# EAGLE design 4-digit-clock (EAGLE 7.5.0)
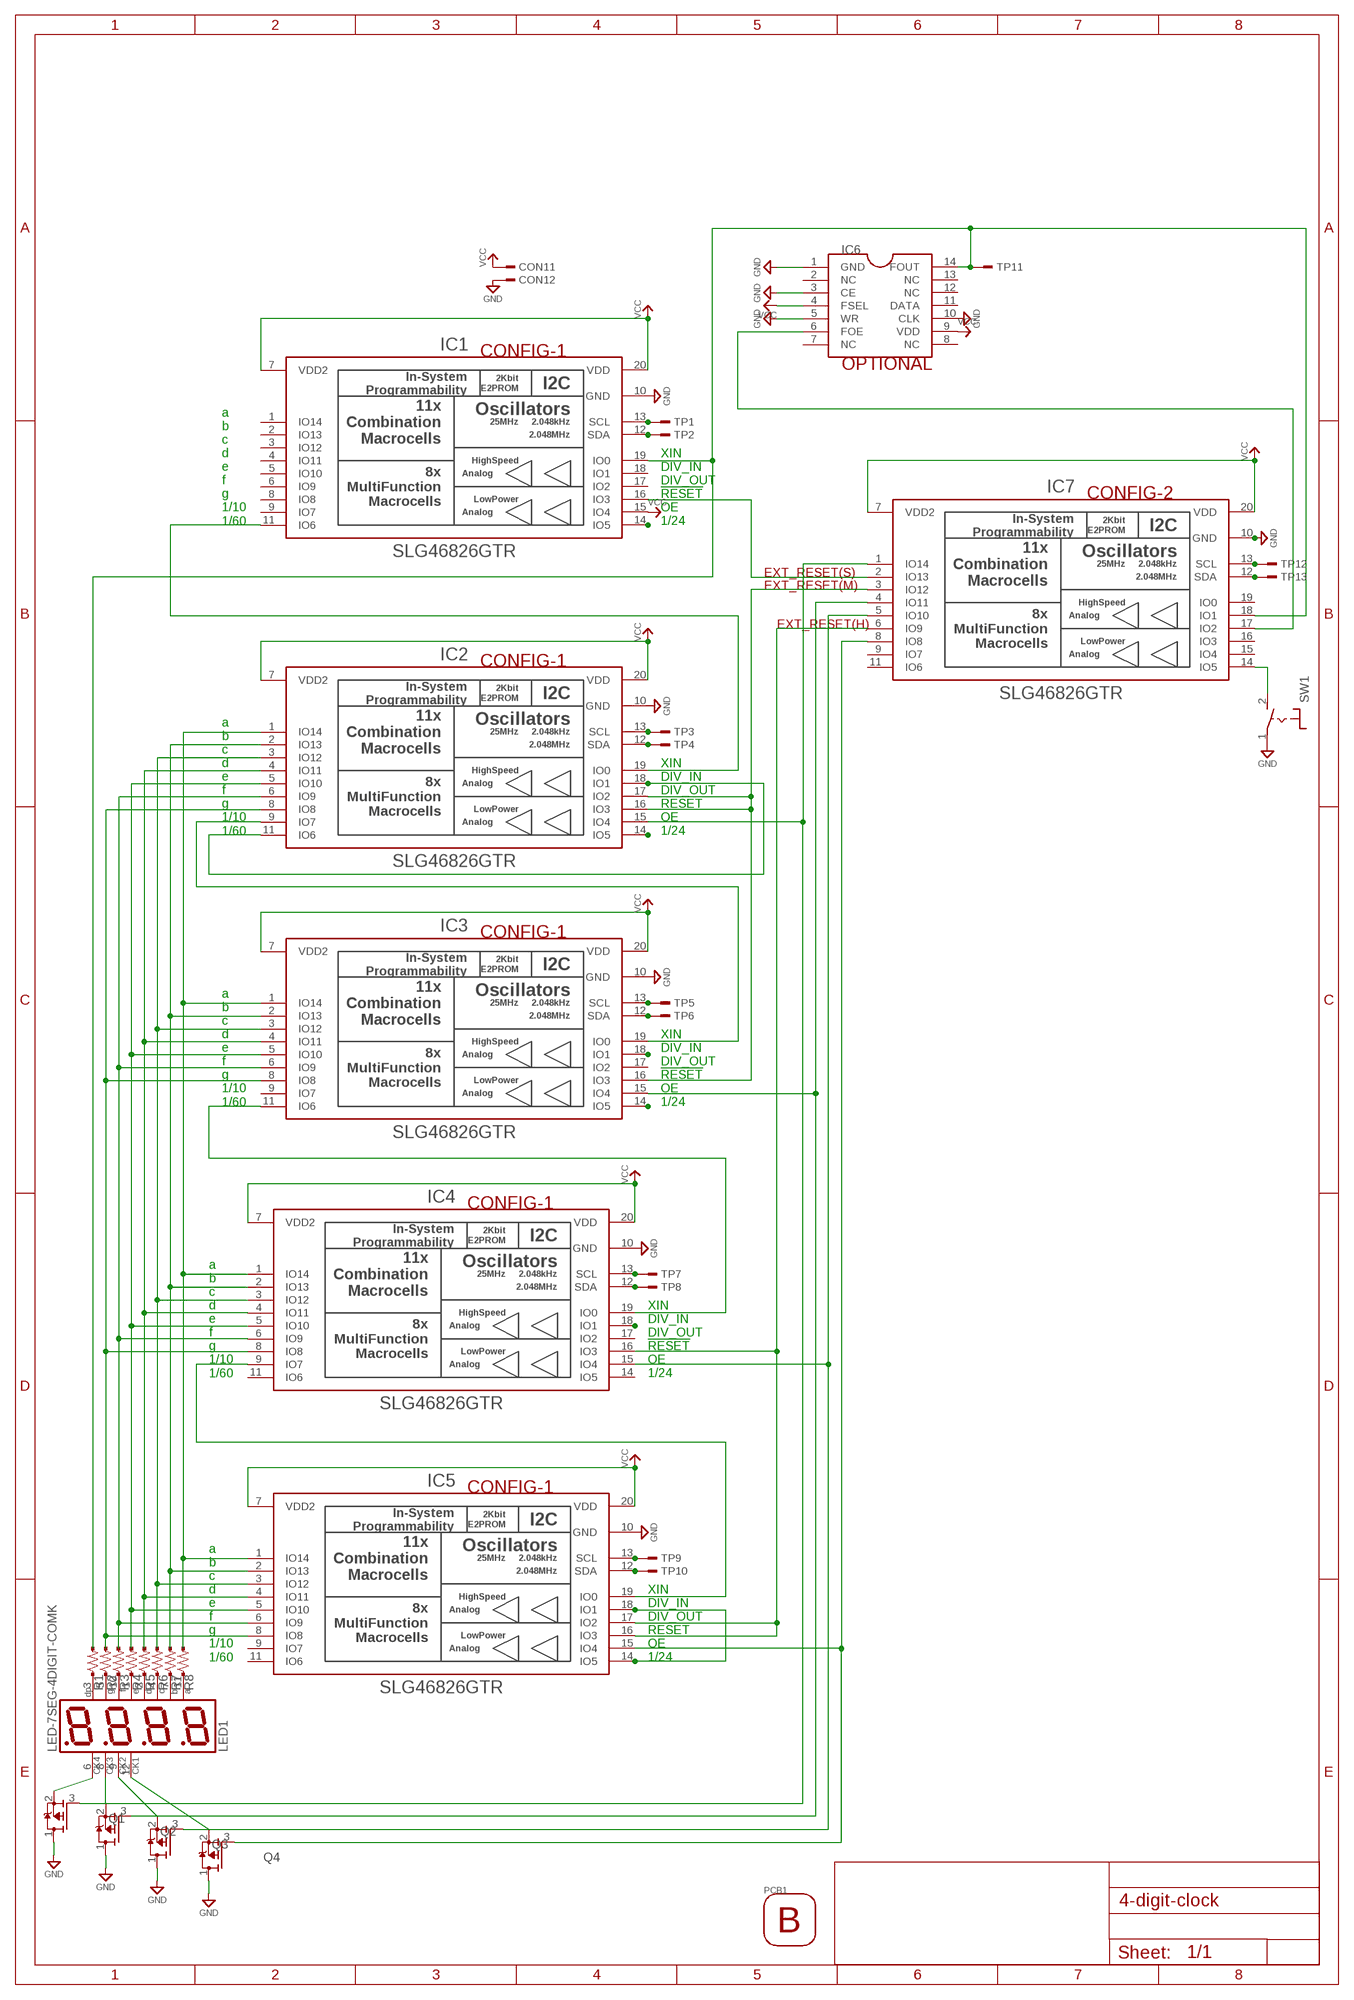
[diagram p0: schematic, sheet 1]

## Parts
CON1  B2B-XH-A  [B2B-XH-A(LF)(SN)]
IC1  SLG46826GTR  [SOT65P650X440-20N]
IC2  SLG46826GTR  [SOT65P650X440-20N]
IC3  SLG46826GTR  [SOT65P650X440-20N]
IC4  SLG46826GTR  [SOT65P650X440-20N]
IC5  SLG46826GTR  [SOT65P650X440-20N]
IC6  RTC-4543SA  [SOT127P1010X500-14N]
IC7  SLG46826GTR  [SOT65P650X440-20N]
LED1  LED-7SEG-4DIGIT-COMK  [LED-7SEG-4DIGIT]
PCB1  P-MCS78A  [P-MCS78A]
Q1  2N7002  [SOT95P300X140-3N]
Q2  2N7002  [SOT95P300X140-3N]
Q3  2N7002  [SOT95P300X140-3N]
Q4  2N7002  [SOT95P300X140-3N]
R1  R-US-1.0K-1005  [C0402]
R2  R-US-1.0K-1005  [C0402]
R3  R-US-1.0K-1005  [C0402]
R4  R-US-1.0K-1005  [C0402]
R5  R-US-1.0K-1005  [C0402]
R6  R-US-1.0K-1005  [C0402]
R7  R-US-1.0K-1005  [C0402]
R8  R-US-1.0K-1005  [C0402]
SW1  TACTSW2-BK-TL1105S  [SW-TACTSW-TL1105S]
TP1  TESTPAD-1608  [TP-1608]
TP2  TESTPAD-1608  [TP-1608]
TP3  TESTPAD-1608  [TP-1608]
TP4  TESTPAD-1608  [TP-1608]
TP5  TESTPAD-1608  [TP-1608]
TP6  TESTPAD-1608  [TP-1608]
TP7  TESTPAD-1608  [TP-1608]
TP8  TESTPAD-1608  [TP-1608]
TP9  TESTPAD-1608  [TP-1608]
TP10  TESTPAD-1608  [TP-1608]
TP11  TESTPAD-1608  [TP-1608]
TP12  TESTPAD-1608  [TP-1608]
TP13  TESTPAD-1608  [TP-1608]

## Nets
GND: CON1.2 IC1.10(GND) IC2.10(GND) IC3.10(GND) IC4.10(GND) IC5.10(GND) IC6.1(GND) IC6.3(CE) IC6.5(WR) IC6.10(CLK) IC7.10(GND) Q1.1(D) Q2.1(D) Q3.1(D) Q4.1(D) SW1.1(P)
N$1: IC2.6(IO9) IC3.6(IO9) IC4.6(IO9) IC5.6(IO9) R3.2
N$2: IC2.4(IO11) IC3.4(IO11) IC4.4(IO11) IC5.4(IO11) R5.2
N$3: IC2.2(IO13) IC3.2(IO13) IC4.2(IO13) IC5.2(IO13) R7.2
N$4: IC2.1(IO14) IC3.1(IO14) IC4.1(IO14) IC5.1(IO14) R8.2
N$5: IC2.3(IO12) IC3.3(IO12) IC4.3(IO12) IC5.3(IO12) R6.2
N$6: IC2.5(IO10) IC3.5(IO10) IC4.5(IO10) IC5.5(IO10) R4.2
N$7: IC2.8(IO8) IC3.8(IO8) IC4.8(IO8) IC5.8(IO8) R2.2
N$8: LED1.6(CA4) Q1.2(S)
N$9: IC2.14(IO5)
N$10: IC1.11(IO6) IC2.19(IO0)
N$11: IC1.19(IO0) IC6.14(FOUT) IC7.18(IO1) R1.2 TP11.TP
N$12: IC2.11(IO6) IC2.18(IO1)
N$13: LED1.8(CA) Q2.2(S)
N$14: LED1.9(CA) Q3.2(S)
N$15: LED1.12(CA) Q4.2(S)
N$16: IC2.15(IO4) IC7.1(IO14) Q1.3(G)
N$17: IC3.15(IO4) IC7.4(IO11) Q2.3(G)
N$18: IC4.15(IO4) IC7.5(IO10) Q3.3(G)
N$19: IC3.18(IO1)
N$20: IC3.14(IO5)
N$21: IC2.9(IO7) IC3.19(IO0)
N$22: IC5.15(IO4) IC7.8(IO8) Q4.3(G)
N$23: LED1.3(DP) R1.1
N$24: IC1.14(IO5)
N$25: IC4.18(IO1)
N$26: IC2.16(IO3) IC2.17(IO2) IC3.16(IO3) IC7.3(IO12)
N$27: IC4.16(IO3) IC5.16(IO3) IC5.17(IO2) IC7.6(IO9)
N$28: IC3.11(IO6) IC4.19(IO0)
N$29: IC2.13(SCL) TP3.TP
N$30: IC2.12(SDA) TP4.TP
N$31: IC3.13(SCL) TP5.TP
N$32: IC3.12(SDA) TP6.TP
N$33: IC4.13(SCL) TP7.TP
N$34: IC4.12(SDA) TP8.TP
N$35: IC5.13(SCL) TP9.TP
N$36: IC5.14(IO5) IC5.18(IO1)
N$37: LED1.5(G) R2.1
N$38: IC4.9(IO7) IC5.19(IO0)
N$39: IC5.12(SDA) TP10.TP
N$40: LED1.10(F) R3.1
N$42: LED1.1(E) R4.1
N$43: LED1.2(D) R5.1
N$44: LED1.4(C) R6.1
N$45: LED1.7(B) R7.1
N$46: LED1.11(A) R8.1
N$47: IC7.13(SCL) TP12.TP
N$48: IC7.12(SDA) TP13.TP
N$49: IC7.14(IO5) SW1.2(S)
N$50: IC6.6(FOE) IC7.17(IO2)
N$51: IC1.16(IO3) IC7.2(IO13)
N$77: IC1.13(SCL) TP1.TP
N$78: IC1.12(SDA) TP2.TP
VCC: CON1.1 IC1.7(VDD2) IC1.15(IO4) IC1.20(VDD) IC2.7(VDD2) IC2.20(VDD) IC3.7(VDD2) IC3.20(VDD) IC4.7(VDD2) IC4.20(VDD) IC5.7(VDD2) IC5.20(VDD) IC6.4(FSEL) IC6.9(VDD) IC7.7(VDD2) IC7.20(VDD)
Unconnected: IC1.1(IO14) IC1.2(IO13) IC1.3(IO12) IC1.4(IO11) IC1.5(IO10) IC1.6(IO9) IC1.8(IO8) IC1.9(IO7) IC1.17(IO2) IC1.18(IO1) IC3.9(IO7) IC3.17(IO2) IC4.11(IO6) IC4.14(IO5) IC4.17(IO2) IC5.9(IO7) IC5.11(IO6) IC6.2(NC) IC6.7(NC) IC6.8(NC) IC6.11(DATA) IC6.12(NC) IC6.13(NC) IC7.9(IO7) IC7.11(IO6) IC7.15(IO4) IC7.16(IO3) IC7.19(IO0)

## Notes on the sheet
- CONFIG-1
- OPTIONAL
- CONFIG-2
- a
  b
  c
  d
  e
  f
  g
  1/10
  1/60
- XIN
  DIV_IN
  DIV_OUT
  !RESET!
  OE
  1/24
- EXT_RESET(S)
- EXT_RESET(M)
- EXT_RESET(H)
- CONFIG-1
- a
  b
  c
  d
  e
  f
  g
  1/10
  1/60
- XIN
  DIV_IN
  DIV_OUT
  !RESET!
  OE
  1/24
- CONFIG-1
- a
  b
  c
  d
  e
  f
  g
  1/10
  1/60
- XIN
  DIV_IN
  DIV_OUT
  !RESET!
  OE
  1/24
- CONFIG-1
- a
  b
  c
  d
  e
  f
  g
  1/10
  1/60
- XIN
  DIV_IN
  DIV_OUT
  !RESET!
  OE
  1/24
- CONFIG-1
- a
  b
  c
  d
  e
  f
  g
  1/10
  1/60
- XIN
  DIV_IN
  DIV_OUT
  !RESET!
  OE
  1/24

## Library data of the parts
CON1 = mylib:B2B-XH-A
IC1-IC5 IC7 = mylib:SLG46826
IC6 = mylib:RTC-4543SA
LED1 = mylib:LED-7SEG-4DIGIT-COMK
PCB1 = mylib:P-MCS78A
Q1-Q4 = mylib:2N7002
R1-R8 = mylib:R-US-*: SMD resistor Packages : -1608 : 1.6 x 0.8 mm -2125 : 2.0 x 1.25 mm -3216 : 3.2 x 1.6 mm; DIGIKEY: P1.00KLCT-ND; SEEED: 301010006; SMD-PAD: 2
SW1 = mylib:TACTSW2-*: 2P tact switch; DIGIKEY: EG1839-ND; MOUSER: EG1839-ND; TH-PAD: 4
TP1-TP13 = mylib:TESTPAD: test points; DIGIKEY: A106145CT-ND; SMD-PAD: 1

## Board
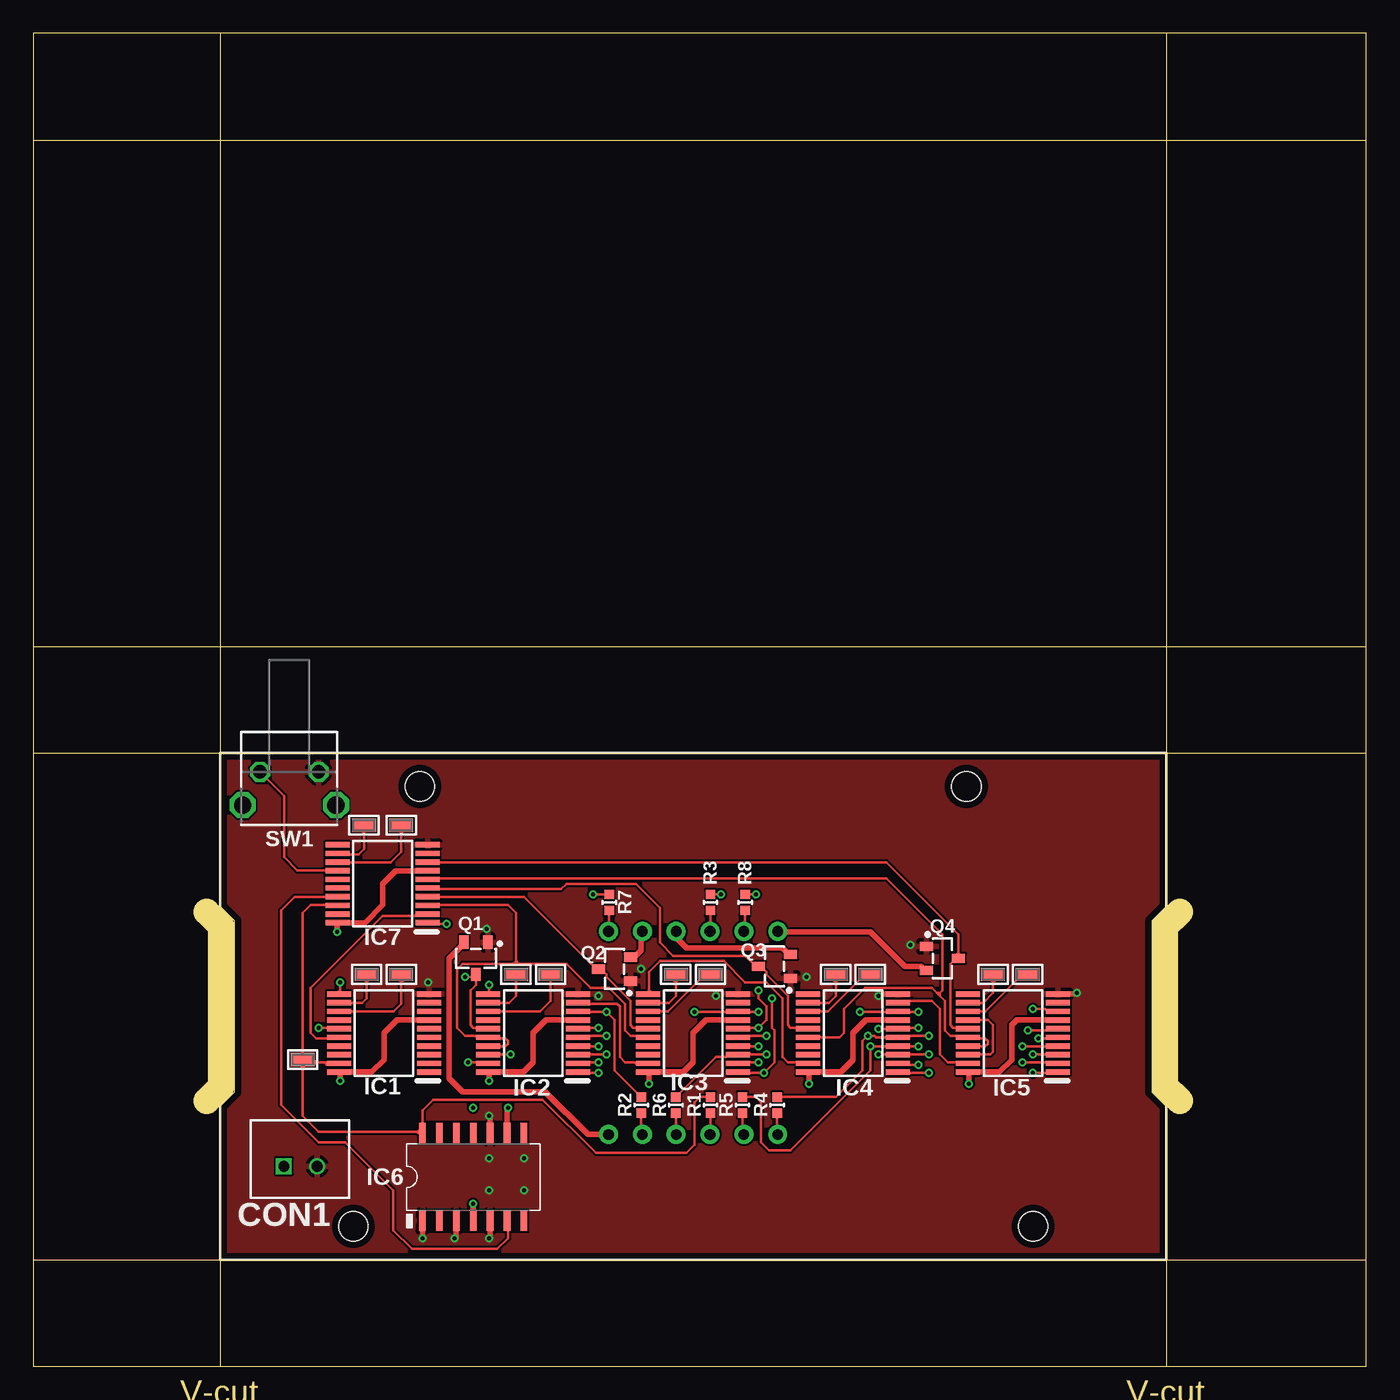
[diagram p1: board, top side]
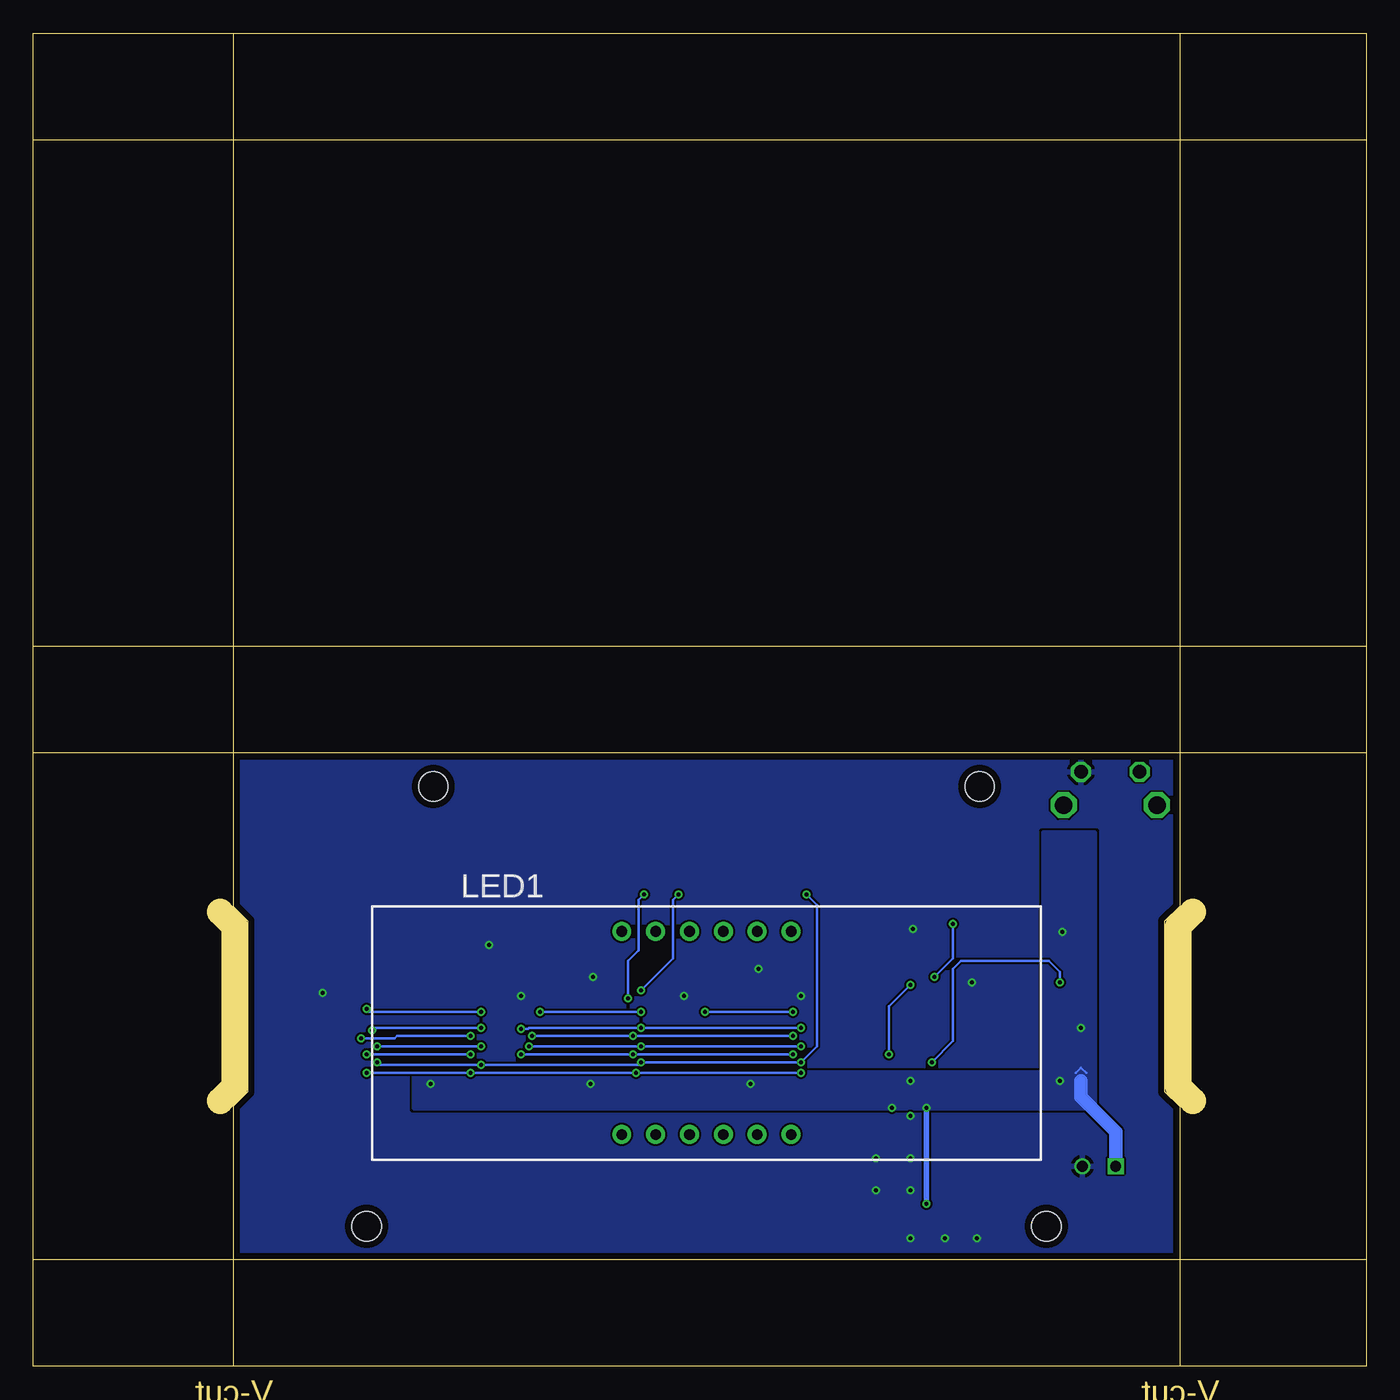
[diagram p2: board, bottom side, seen from below]

Size 100 x 100 mm. Coordinates in mm from the lower left corner, seen from the top.
Outline: 14,0 0,0 0,8
Outline: 14,0 85,0
Outline: 85,0 100,0 100,8
Outline: 100,8 100,46
Outline: 100,46 100,54
Outline: 100,54 100,92
Outline: 100,92 100,100 85,100
Outline: 85,100 14,100
Outline: 14,100 0,100 0,92
Outline: 0,92 0,54
Outline: 0,54 0,46
Outline: 0,46 0,8
Outline: 14,100 14,0
Outline: 85,100 85,0
Outline: 0,8 100,8
Outline: 0,46 100,46
Outline: 0,54 100,54
Outline: 0,92 100,92
Copper layers (1*16): Top 0.035mm / dielectric 1.5mm / Bottom 0.035mm
Design rules "default *": minimum track width 0.15mm, minimum drill 0.3mm, track to track 0.15mm, track to pad 0.15mm, pad to pad 0.15mm, via to via 0.15mm, smd to smd 0.15mm, copper to edge 0.5mm, drill to drill 0.15mm, minimum pad ring 0.15mm, minimum via ring 0.15mm, stop-mask expansion 4mil, vias tented up to drill 0mil, thermal gap 10mil
tRestrict: area 28.8,10 to 37.2,11.8; area 28.8,16.6 to 37.2,18.4

### Footprints (pad centres in the part's own frame; a part is rotated, then mirrored left to right if it is on the bottom)
B2B-XH-A(LF)(SN) = drill 0.8 square: 1 1.21,0 | drill 0.8: 2 -1.29,0
SOT65P650X440-20N = smd 0.4 x 1.8: 1 -2.925,-3.375; 2 -2.275,-3.375; 3 -1.625,-3.375; 4 -0.975,-3.375; 5 -0.325,-3.375; 6 0.325,-3.375; 7 0.975,-3.375; 8 1.625,-3.375; 9 2.275,-3.375; 10 2.925,-3.375; 11 2.925,3.375; 12 2.275,3.375; 13 1.625,3.375; 14 0.975,3.375; 15 0.325,3.375; 16 -0.325,3.375; 17 -0.975,3.375; 18 -1.625,3.375; 19 -2.275,3.375; 20 -2.925,3.375
SOT127P1010X500-14N = smd 0.5 x 1.5: 1 -3.81,-3.302; 2 -2.54,-3.302; 3 -1.27,-3.302; 4 0,-3.302; 5 1.27,-3.302; 6 2.54,-3.302; 7 3.81,-3.302; 8 3.81,3.302; 9 2.54,3.302; 10 1.27,3.302; 11 0,3.302; 12 -1.27,3.302; 13 -2.54,3.302; 14 -3.81,3.302
LED-7SEG-4DIGIT = drill 0.8 pad 1.422: 1 -6.35,-7.62; 2 -3.81,-7.62; 3 -1.27,-7.62; 4 1.27,-7.62; 5 3.81,-7.62; 6 6.35,-7.62; 7 6.35,7.62; 8 3.81,7.62; 9 1.27,7.62; 10 -1.27,7.62; 11 -3.81,7.62; 12 -6.35,7.62
P-MCS78A = hole 2.2: -20.5,16.5; 20.5,16.5; -25.5,-16.5; 25.5,-16.5
SOT95P300X140-3N = smd 0.7 x 1: 1 -0.9,-1.2; 2 0.9,-1.2; 3 0,1.2
C0402 = smd 0.7 x 0.7: 1 -0.6,0; 2 0.6,0
SW-TACTSW-TL1105S = drill 1 octagon: 1 -2.2,0; 2 2.2,0 | drill 1.3 octagon: P$1 -3.5,2.5; P$2 3.5,2.5
TP-1608 = smd 1.8 x 1: TP 0,0

### Placement (x,y rotation side)
CON1  20,15 180 top
IC1  26.3,25 90 top
IC2  37.5,25 90 top
IC3  49.5,25 90 top
IC4  61.5,25 90 top
IC5  73.5,25 90 top
IC6  33,14.2 0 top
IC7  26.2,36.2 90 top
LED1  49.5,25 0 bottom
PCB1  49.5,27 0 top
Q1  33.2,30.6 180 top
Q2  43.6,29.8 90 top
Q3  55.6,30 90 top
Q4  68.2,30.6 270 top
R1  50.8,19.6 90 top
R2  45.6,19.6 90 top
R3  50.8,34.8 90 top
R4  55.8,19.6 90 top
R5  53.2,19.6 90 top
R6  48.2,19.6 90 top
R7  43.2,34.8 90 top
R8  53.4,34.8 90 top
SW1  19.2,44.6 180 top
TP1  27.6,29.4 0 top
TP2  25,29.4 0 top
TP3  38.8,29.4 180 top
TP4  36.2,29.4 0 top
TP5  50.8,29.4 0 top
TP6  48.2,29.4 0 top
TP7  62.8,29.4 0 top
TP8  60.2,29.4 0 top
TP9  74.6,29.4 0 top
TP10  72,29.4 0 top
TP11  20.2,23 0 top
TP12  27.6,40.6 0 top
TP13  24.8,40.6 0 top

### Tracks (layer width: path | path; a pad name or v marks a point on that pad's centre or on a via)
GND  (via drill 0.3)
  Top 0.4: IC4.10 63.52,27.93 v63.4,27.8 | IC5.10 78.22,27.93 v78.3,28 | IC6.5 34.27,9.67 v34.2,9.6 | IC6.3 31.73,9.73 v31.6,9.6 | IC6.1 v29.19,9.61 v29.2,9.6 | IC6.10 34.27,18.73 v34.2,18.8
  other vias: 42.4,27.8 51.2,27.8 29.6,28.8 34.2,15.6 34.2,13.2 36.8,13.2 36.8,15.6 34,32.8 45.6,29.8 58,29.2 65.8,31.6
  pour Bottom (rank 2): 13.7,46.2 85.5,46.2 85.5,7.4 13.7,7.4
  pour Top: 13.7,46.4 85.5,46.4 85.5,7.6 13.7,7.6
N$1  (via drill 0.3)
  Top 0.2: IC2.6 41.52,25.32 41.6,25.4 v42.4,25.4 | IC3.6 53.62,25.32 53.7,25.4 v54.4,25.4 55,26 55,27 54.4,27.6 v54.4,28.2 | v66.4,25.4 65.7,25.4 65.62,25.32 IC4.6 64.12,25.32 64.1,25.3 v63.4,25.3 | IC5.6 76.22,25.32 76.1,25.2 v74.6,25.2 | R3.2 v51.6,35.4
  Bottom 0.2: v42.4,25.4 v54.4,25.4 62.8,25.4 62.9,25.3 v63.4,25.3 | v66.4,25.4 74.4,25.4 v74.6,25.2 | v54.4,28.2 52,30.6 52,35 v51.6,35.4
N$2  (via drill 0.3)
  Top 0.2: IC2.4 41.67,24.02 41.7,24 v42.4,24 | IC3.4 53.67,24.02 53.7,24 v54.4,24 | v66.4,24 65.7,24 65.67,24.02 IC4.4 64.12,24.02 64.1,24 v62.8,24 62.8,22.2 56.8,16.2 55.2,16.2 54.6,16.8 54.6,19.8 54.2,20.2 R5.2 | IC5.4 76.12,24.02 76.1,24 v74.2,24
  Bottom 0.2: v74.2,24 v66.4,24 | v62.8,24 v54.4,24 v42.4,24
N$3  (via drill 0.3)
  Top 0.2: IC2.2 41.62,22.73 41.7,22.8 v42.4,22.8 | IC3.2 53.62,22.73 53.7,22.8 v54.4,22.8 | IC4.2 65.58,22.73 65.7,22.6 v66.4,22.6 | IC5.2 76.17,22.73 76.1,22.8 v74.2,22.8 | R7.2 v42,35.4
  Bottom 0.2: v74.2,22.8 74,22.6 v66.4,22.6 54.6,22.6 v54.4,22.8 v42.4,22.8 41.2,24 41.2,34.6 v42,35.4
N$4  (via drill 0.3)
  Top 0.2: IC3.1 53.62,22.07 53.7,22 v54.8,22 55.6,22.8 55.6,25.2 55.4,25.4 v55.4,27.6 | IC4.1 65.62,22.07 65.7,22 v67.2,22 | IC5.1 76.17,22.07 76.1,22 v75,22 | IC2.1 41.62,22.07 41.7,22 v42.4,22 | R8.2 v54.2,35.4
  Bottom 0.2: v42.4,22 v54.8,22 v67.2,22 v75,22 | v55.4,27.6 55.4,30.4 54.6,31.2 54.6,35 v54.2,35.4
N$5  (via drill 0.3)
  Top 0.2: IC2.3 41.67,23.38 41.7,23.4 v43,23.4 | v55,23.4 53.7,23.4 53.67,23.38 IC3.3 52.17,23.38 52,23.2 51.2,23.2 R6.2 | v67.2,23.4 65.7,23.4 65.67,23.38 IC4.3 64.12,23.38 64.1,23.4 v63.4,23.4 | IC5.3 76.12,23.38 76.1,23.4 v75,23.4
  Bottom 0.2: v63.4,23.4 v55,23.4 v43,23.4 | v75,23.4 v67.2,23.4
N$6  (via drill 0.3)
  Top 0.2: IC2.5 41.58,24.68 41.7,24.8 v43,24.8 | IC3.5 53.58,24.68 53.7,24.8 v55,24.8 | v67.2,24.8 65.7,24.8 65.58,24.68 IC4.5 63.23,24.68 63.1,24.8 v62.6,24.8 62.2,24.4 62.2,22.2 60.2,20.2 R4.2 | IC5.5 76.17,24.68 76.1,24.6 v75.4,24.6
  Bottom 0.2: v43,24.8 v55,24.8 v62.6,24.8 | v75.4,24.6 72.9,24.6 72.7,24.8 v67.2,24.8
N$7  (via drill 0.3)
  Top 0.2: IC2.8 41.67,26.62 41.7,26.6 v43,26.6 43.6,26 43.6,22.2 R2.2 | v54.4,26.6 53.7,26.6 53.67,26.62 IC3.8 52.52,26.62 52.5,26.6 v49.6,26.6 | v66.4,26.6 65.7,26.6 65.67,26.62 IC4.8 64.12,26.62 64.1,26.6 v62,26.6 | IC5.8 76.08,26.62 75.9,26.8 v75,26.8
  Bottom 0.2: v43,26.6 v49.6,26.6 | v54.4,26.6 v62,26.6 | v66.4,26.6 74.8,26.6 v75,26.8
N$8
  Top 0.4: Q1.2 32.1,31.5 31.2,30.6 31.2,21.6 32.2,20.6 38.4,20.6 41.6,17.4 43.2,17.4 43.18,17.38 LED1.6
N$10  (via drill 0.3)
  Top 0.2: IC2.19 33.88,22.73 33.8,22.8 v32.6,22.8 | IC1.11 23,28 23,28.2 | 23,28.2 v23,28.8 | 23,28.2 22.8,28 23.2,28 23,28.2
  Bottom 0.2: v32.6,22.8 31,24.4 31,29.8 30.4,30.4 23.8,30.4 23,29.6 v23,28.8
N$11
  Top 0.2: 20.2,22.4 20.2,18.8 21.4,17.6 28.8,17.6 | 20.2,22.4 TP11.TP | IC1.19 22.27,22.73 22.2,22.8 21.8,22.8 | 21.8,22.8 21.2,22.8 | 21.2,22.8 20.4,22.8 TP11.TP | 20,22.6 20.2,22.4 | 20.2,22.4 20.4,22.6 | 21,23 21.2,22.8 | 21.2,22.8 21,22.6 | 21.8,22.8 22,22.6 | 28.8,17.6 29.2,17.6 29.19,17.59 IC6.14 29.2,17.51 29.2,19.2 30,20 38.2,20 42.2,16 49,16 49.6,16.6 49.6,19.8 50,20.2 R1.2 | 29,17.8 28.8,17.6 | 28.8,17.6 29,17.4 | IC7.18 22.8,34.6 20.8,34.6 20.2,34 20.2,23.6 | 20.2,23.6 TP11.TP | 20.2,23.6 20,23.4 20.4,23.4 20.2,23.6
N$12  (via drill 0.3)
  Top 0.2: IC2.11 34.2,28 v34.2,28.6 | 35.4,23.4 v35.8,23.4 34.8,23.4 34.77,23.38 IC2.18
  Bottom 0.2: v35.8,23.4 35.8,27 v34.2,28.6
N$13
  Top 0.4: Q2.2 45.1,30.7 45.6,31.2 45.6,32.4 45.69,32.49 LED1.8
N$14
  Top 0.4: Q3.2 56.7,30.9 56.2,31.4 49,31.4 48.4,32 48.4,32.4 48.23,32.57 LED1.9
N$15
  Top 0.4: Q4.2 66.9,29.7 66.6,30 65.4,30 62.8,32.6 55.87,32.6 LED1.12
N$16  (via drill 0.3)
  Top 0.2: IC2.15 33.48,25.32 33.4,25.4 33,25.4 32.8,25.6 32.8,28.2 33.2,28.6 Q1.3 33,29.2 v32.4,29.2 | IC7.1 30.32,33.27 30.4,33.2 v31,33.2
  Bottom 0.2: v31,33.2 31,30.6 v32.4,29.2
N$17
  Top 0.2: IC3.15 46.08,25.32 46,25.4 45,25.4 44.8,25.6 44.8,27.4 43,29.2 43,29.4 42.6,29.8 Q2.3 42.2,29.8 36.8,35.2 30.4,35.2 30.38,35.23 IC7.4
N$18
  Top 0.2: IC4.15 58.08,25.32 58,25.4 56.8,25.4 56.6,25.6 56.6,27.8 55,29.4 55,29.6 54.6,30 Q3.3 54.2,30 53.4,30.8 48,30.8 47,31.8 47,34.4 45.2,36.2 40,36.2 39.6,35.8 30.4,35.8 30.32,35.88 IC7.5
N$21
  Top 0.2: IC3.19 45.17,22.73 45.1,22.8 44.4,22.8 44,23.2 44,27 43.8,27.2 41.8,27.2 41.73,27.27 IC2.9
N$22
  Top 0.2: IC5.15 70.08,25.32 70,25.4 69,25.4 68.8,25.6 68.8,30.2 69.2,30.6 Q4.3 69.4,31 | 69.4,31 69.4,32.4 64,37.8 30.4,37.8 30.38,37.83 IC7.8 | 69.4,31 69.2,30.8 69.6,30.8 69.4,31
N$23
  Top 0.2: LED1.3 50.8,17.4 R1.1
N$26
  Top 0.2: IC3.16 45.42,24.68 45.3,24.8 44.8,24.8 44.4,25.2 44.4,27.2 43.2,28.4 41.8,28.4 40,30.2 36.4,30.2 | 36,30.2 32.2,30.2 31.8,29.8 31.8,25.4 32.4,24.8 33.6,24.8 33.73,24.68 IC2.16 34.92,24.68 35,24.6 35.4,24.6 35.6,24.4 35.6,24.2 35.4,24 34.8,24 34.8,24.02 IC2.17 | 36,30.2 36.2,30.2 | 36.2,30.2 36.4,30.2 | IC7.3 30.38,34.58 30.4,34.6 35.6,34.6 36.2,34 36.2,30.4 | 36.2,30.4 36.2,30.2 | 36.2,30.4 36,30.2 | 36.2,30.4 36.4,30.2
N$27
  Top 0.2: IC4.16 60.48,24.68 60.8,25 60.8,26.8 62.4,28.4 67.4,28.4 67.8,28 | 67.8,28 67.9,27.9 | 67.9,27.9 68,27.8 | 68,27.8 68.4,27.4 68.4,25.2 68.8,24.8 69.3,24.8 69.42,24.68 IC5.16 70.72,24.68 70.8,24.6 71.4,24.6 71.6,24.4 71.6,24.2 71.4,24 70.8,24 70.78,24.02 IC5.17 | IC7.6 30.32,36.52 30.4,36.6 64,36.6 68.2,32.4 68.2,28.2 68,28 | 68,28 67.9,27.9 | 67.8,28 68,28 | 68,28 68,27.8
N$28
  Top 0.2: IC4.19 57.38,22.73 57.3,22.8 56.6,22.8 56.2,23.2 56.2,27.6 55,28.8 53.4,28.8 51.8,30.4 47,30.4 46.2,29.6 46.2,28.2 | IC3.11 46.2,28 46.2,28.2 | 46.2,28.2 46,28 | 46.2,28.2 46.4,28
N$29
  Top 0.2: IC2.13 38.02,26.62 38.8,27.4 TP3.TP
N$30
  Top 0.2: IC2.12 35.67,27.27 36.2,27.8 TP4.TP
N$31
  Top 0.2: TP5.TP 50.4,29.4 47.62,26.62 IC3.13
N$32
  Top 0.2: IC3.12 47.67,27.27 48.2,27.8 48.2,28.8 | 48.2,28.8 TP6.TP | 48.2,28.8 48,29 | 48.2,28.8 48.4,29
N$33
  Top 0.2: IC4.13 59.62,26.62 62.4,29.4 TP7.TP
N$34
  Top 0.2: IC4.12 59.67,27.27 60.2,27.8 60.2,28.8 | 60.2,28.8 TP8.TP | 60.2,28.8 60,29 | 60.2,28.8 60.4,29
N$35
  Top 0.2: TP9.TP 74.2,29.4 71.42,26.62 IC5.13
N$36
  Top 0.2: IC5.14 70.78,25.98 70.8,26 71.6,26 72,25.6 72,23.6 71.8,23.4 70.8,23.4 70.78,23.38 IC5.18
N$37
  Top 0.2: LED1.5 45.62,17.38 45.6,17.4 R2.1
N$38
  Top 0.2: IC4.9 65.58,27.27 65.7,27.4 67.4,27.4 68,26.8 68,23.4 68.6,22.8 69.3,22.8 69.38,22.73 IC5.19
N$39
  Top 0.2: IC5.12 71.28,27.27 72,28 72,28.8 | 72,28.8 TP10.TP | 72,28.8 71.8,29 | 72,28.8 72.2,29
N$40
  Top 0.2: LED1.10 50.77,32.77 50.8,32.8 R3.1
N$42
  Top 0.2: LED1.1 55.82,17.38 55.8,17.4 R4.1
N$43
  Top 0.2: LED1.2 53.22,17.38 53.2,17.4 R5.1
N$44
  Top 0.2: LED1.4 48.2,17.4 R6.1
N$45
  Top 0.2: LED1.7 43.15,32.75 43.2,32.8 R7.1
N$46
  Top 0.2: LED1.11 53.31,32.71 53.4,32.8 R8.1
N$47
  Top 0.2: IC7.13 23.57,37.83 23.6,37.8 26.8,37.8 27.6,38.6 27.6,40 | 27.6,40 TP12.TP | 27.6,40 27.4,40.2 27.8,40.2 27.6,40
N$48
  Top 0.2: 24.8,40 24.8,38.8 24.4,38.4 23.6,38.4 23.52,38.48 IC7.12 | 24.8,40 TP13.TP | 24.8,40 24.6,40.2 25,40.2 24.8,40
N$49
  Top 0.2: IC7.14 22.02,37.17 22,37.2 19.8,37.2 18.8,38.2 18.8,42.8 SW1.2
N$50
  Top 0.2: IC7.17 22.8,35.2 19.6,35.2 18.6,34.2 18.6,19.6 21.4,16.8 23.4,16.8 27,13.2 27,10.2 28.4,8.8 34.8,8.8 35.6,9.6 35.6,10.8 35.54,10.86 IC6.6
N$51
  Top 0.2: IC7.2 28.93,33.92 28.8,33.8 26.2,33.8 20.8,28.4 20.8,25 21.2,24.6 22.2,24.6 22.27,24.68 IC1.16
N$77
  Top 0.2: IC1.13 27.02,26.62 27.6,27.2 27.6,28.8 | TP1.TP 27.6,28.8 | 27.4,29 27.6,28.8 | 27.6,28.8 27.8,29
N$78
  Top 0.2: IC1.12 24.68,27.27 25,27.6 25,28.8 | 25,28.8 TP2.TP | 24.8,29 25,28.8 | 25,28.8 25.2,29
VCC  (via drill 0.3)
  Top 0.2: IC1.15 22.27,25.32 22.2,25.4 v21.4,25.4
  Top 0.4: IC1.7 27.27,25.98 26.3,25 26.3,23 25.38,22.07 IC1.20 23,22 v23,21.4 | IC2.7 38.48,25.98 37.5,25 37.5,22.8 36.77,22.07 IC2.20 34.2,22 v34.2,21.4 | IC3.7 50.48,25.98 49.5,25 49.5,22.8 48.77,22.07 IC3.20 46.2,22 v46.2,21.2 | IC4.7 62.48,25.98 61.5,25 61.5,23 60.58,22.07 IC4.20 58.2,22 v58.2,21.2 | IC5.7 73.78,25.98 73.4,25.6 73.4,23 72.47,22.07 IC5.20 70.2,22 v70.2,21.2 | IC6.9 35.54,19.34 v35.6,19.4 | IC7.7 27.18,37.17 26.2,36.2 26.2,34.6 24.88,33.27 IC7.20 22.82,33.23 22.8,33.2 v22.8,32.6 | v33,12.2 IC6.4
  Bottom 0.2: 21,22 21.4,22.4 21.8,22
  Bottom 0.4: v33,19.4 v33,12.2
  Bottom 1: CON1.1 18.79,17.59 21.4,20.2 21.4,21.4
  pour Bottom: 20.4,19.4 20.4,40 24.2,40 24.2,22 71.4,22 71.4,19.4

### Text on the board
Dimension: V-cut | V-cut | V-cut | V-cut | V-cut | V-cut